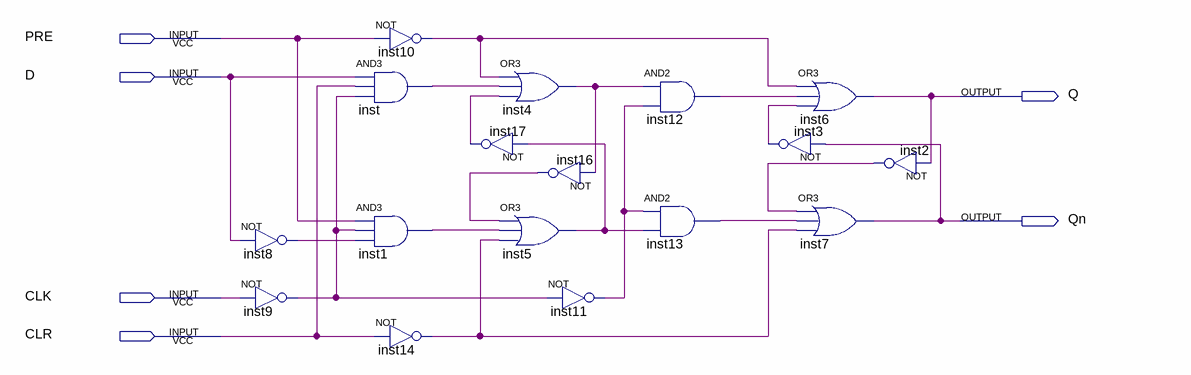
[diagram p0: schematic sheet]
// Quartus schematic FLIPFLOP-D.bdf as structural Verilog: 17 symbols, 6 pins
module \FLIPFLOP-D  (
  input  PRE,
  input  D,
  input  CLK,
  input  CLR,
  output Q,
  output Qn
);

  wire inst1_out, inst2_out, inst3_out, inst4_out, inst5_out, inst8_out, inst9_out, inst10_out, inst11_out,
       inst12_out, inst13_out, inst14_out, inst16_out, inst17_out, inst_out;

  not inst8 (inst8_out, D);
  not inst9 (inst9_out, CLK);
  not inst10 (inst10_out, PRE);
  and inst (inst_out, D, CLR, inst9_out);
  and inst1 (inst1_out, PRE, inst9_out, inst8_out);
  not inst14 (inst14_out, CLR);
  or inst4 (inst4_out, inst10_out, inst_out, inst17_out);
  not inst17 (inst17_out, inst5_out);
  or inst5 (inst5_out, inst16_out, inst1_out, inst14_out);
  not inst16 (inst16_out, inst4_out);
  not inst11 (inst11_out, inst9_out);
  and inst12 (inst12_out, inst4_out, inst11_out);
  and inst13 (inst13_out, inst11_out, inst5_out);
  or inst6 (Q, inst10_out, inst12_out, inst3_out);
  not inst3 (inst3_out, Qn);
  or inst7 (Qn, inst2_out, inst13_out, inst14_out);
  not inst2 (inst2_out, Q);
endmodule
